# Altium schematic sheet USB.SchDoc
size A4; SheetNumber: 4; SheetTotal: 4
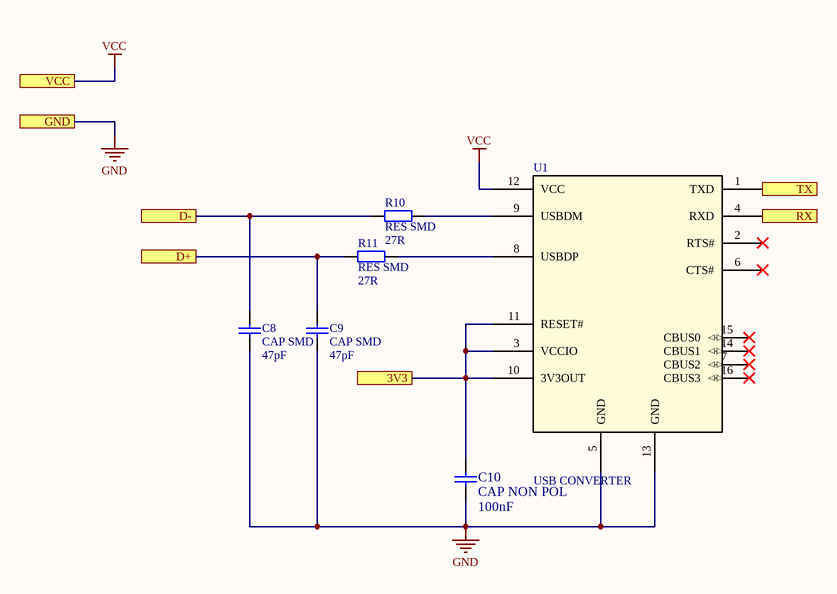
[diagram p0: USB.SchDoc]

## Parts
C8  CAP SMD  value 47pF  [CAP SMD]
C9  CAP SMD  value 47pF  [CAP SMD]
C10  CAP NON POL  value 100nF  [Capacitor 100nF]
R10  RES SMD  value 27R  [RES SMDD]
R11  RES SMD  value 27R  [RES SMDD]
U1  USB CONVERTER  [CONVERSOR USB PARA UART]

## Ports
3V3, D+, D-, GND, RX, TX, VCC

## Nets
GND: C8.2 C9.2 C10.1 U1.5(GND) U1.13(GND) ; port GND
VCC: U1.12(VCC) ; port VCC
3V3: C10.2 U1.3(VCCIO) U1.10(3V3OUT) U1.11(RESET#) ; port 3V3
D+: C9.1 R11.1 ; port D+
D-: C8.1 R10.1 ; port D-
RX: U1.4(RXD) ; port RX
TX: U1.1(TXD) ; port TX
NetR10_2: R10.2 U1.9(USBDM)
NetR11_2: R11.2 U1.8(USBDP)

Not connected (* = marked no-connect by the designer): U1 2(RTS#)* 6(CTS#)* 7(CBUS2)* 14(CBUS1)* 15(CBUS0)* 16(CBUS3)*

## Library data of the parts
C8 C9 = CONDENSADOR SMD: Capacitor (Semiconductor SIM Model); Published: 8-Jun-2000; LatestRevisionDate: 29-May-2009; LatestRevisionNote: IPC-7351 Footprint Added.; PackageReference: C1206; Publisher: Altium Limited; PackageDescription: Chip Capacitor
C10 = Cap: Capacitor; Published: 8-Jun-2000; LatestRevisionDate: 17-Jul-2002; LatestRevisionNote: Re-released for DXP Platform.; PackageReference: RAD-0.3; Publisher: Altium Limited; PackageDescription: Radial Cap, Thru-Hole; 2 Leads; 0.3 in Pin Spacing
R10 R11 = RES SMD: Resistor; Published: 8-Jun-2000; LatestRevisionDate: 17-Jul-2002; LatestRevisionNote: Re-released for DXP Platform.; PackageReference: AXIAL-0.4; Publisher: Altium Limited; PackageDescription: Axial Device, Thru-Hole; 2 Leads; 0.4 in Pin Spacing
U1 = FT230XS-R: No Description Available; Mfr_Name: FTDI, Future Technology Devices International Ltd; Copyright: Copyright (C) 2023 Ultra Librarian. All rights reserved.; Manufacturer_Part_Number: FT230XS-R; RefDes: RefDes; Type: DEV